# Altium schematic sheet H3_SDCard.SchDoc
size A4
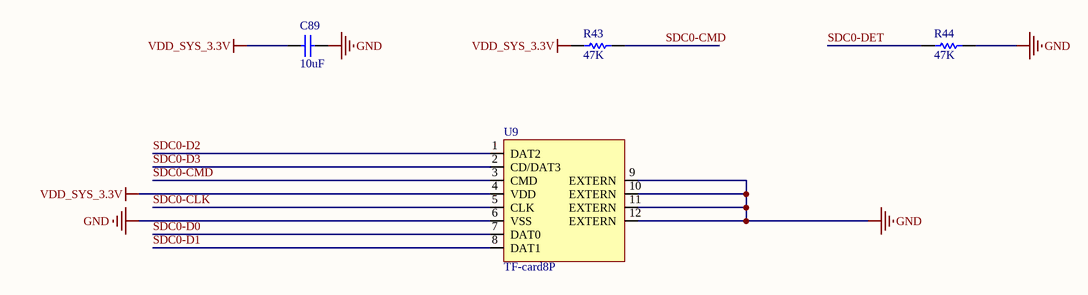
[diagram p0: H3_SDCard.SchDoc]

## Parts
C89  10uF  [C0402]
R43  47K  [R0402]
R44  47K  [R0402]
U9  TF-card8P  [TF-8P - duplicate]

## Nets
GND: C89.1 R44.1 U9.6(VSS) U9.9(EXTERN) U9.10(EXTERN) U9.11(EXTERN) U9.12(EXTERN)
VDD_SYS_3.3V: C89.2 R43.2 U9.4(VDD)
SDC0-CLK: U9.5(CLK)
SDC0-CMD: R43.1 U9.3(CMD)
SDC0-D0: U9.7(DAT0)
SDC0-D1: U9.8(DAT1)
SDC0-D2: U9.1(DAT2)
SDC0-D3: U9.2(CD/DAT3)
SDC0-DET: R44.2

## Library data of the parts
C89 = C0603: 电容; Published: 8-Jun-2000; LatestRevisionDate: 17-Jul-2002; LatestRevisionNote: Re-released for DXP Platform.; PackageReference: RAD-0.3; Publisher: Altium Limited; PackageDescription: Radial Cap, Thru-Hole; 2 Leads; 0.3 in Pin Spacing; UnitPrice: 0.02
R43 R44 = RES0402: 电阻; Published: 8-Jun-2000; LatestRevisionDate: 17-Jul-2002; LatestRevisionNote: Re-released for DXP Platform.; PackageReference: AXIAL-0.3; Publisher: Altium Limited; PackageDescription: Axial Device, Thru-Hole; 2 Leads; 0.3 in Pin Spacing